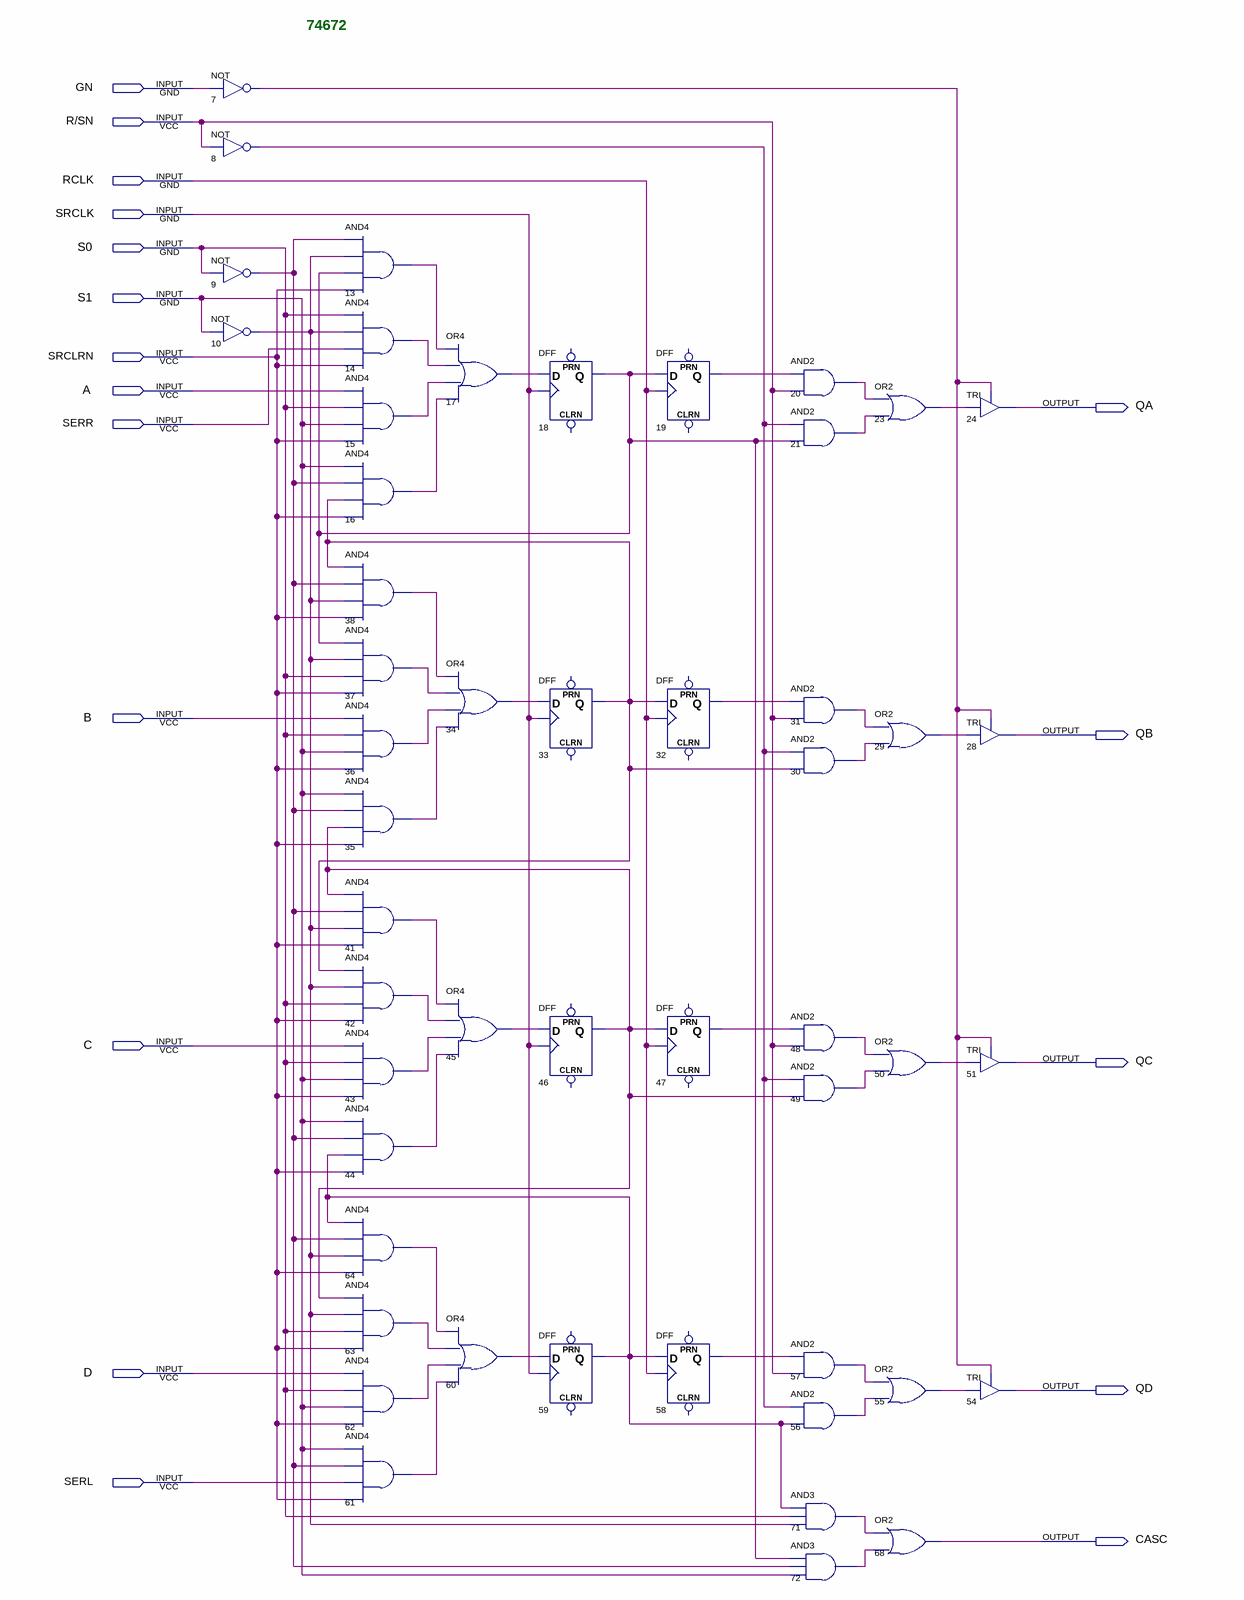
[diagram p0: schematic sheet]
// Quartus schematic 74672.bdf as structural Verilog: 51 symbols, 18 pins
module \74672  (
  input  GN,
  input  \R/SN ,
  input  RCLK,
  input  SRCLK,
  input  S0,
  input  S1,
  input  SRCLRN,
  input  A,
  input  SERR,
  input  B,
  input  C,
  input  D,
  input  SERL,
  output QA,
  output QB,
  output QC,
  output QD,
  output CASC
);

  wire n7_out, n8_out, n9_out, n10_out, n13_out, n14_out, n15_out, n16_out, n17_out, n18_q, n19_q, n20_out,
       n21_out, n23_out, n29_out, n30_out, n31_out, n32_q, n33_q, n34_out, n35_out, n36_out, n37_out,
       n38_out, n41_out, n42_out, n43_out, n44_out, n45_out, n46_q, n47_q, n48_out, n49_out, n50_out,
       n55_out, n56_out, n57_out, n58_q, n59_q, n60_out, n61_out, n62_out, n63_out, n64_out, n71_out, n72_out;

  not u_7 (n7_out, GN);
  not u_8 (n8_out, \R/SN );
  not u_9 (n9_out, S0);
  not u_10 (n10_out, S1);
  and u_13 (n13_out, n9_out, n10_out, n18_q, SRCLRN);
  and u_14 (n14_out, S0, n10_out, SERR, SRCLRN);
  and u_15 (n15_out, A, S0, S1, SRCLRN);
  and u_16 (n16_out, S1, n9_out, n33_q, SRCLRN);
  and u_38 (n38_out, n33_q, n9_out, n10_out, SRCLRN);
  and u_37 (n37_out, n18_q, n10_out, S0, SRCLRN);
  and u_36 (n36_out, B, S0, S1, SRCLRN);
  and u_35 (n35_out, S1, n9_out, n46_q, SRCLRN);
  and u_41 (n41_out, n46_q, n9_out, n10_out, SRCLRN);
  and u_42 (n42_out, n33_q, n10_out, S0, SRCLRN);
  and u_43 (n43_out, C, S0, S1, SRCLRN);
  and u_44 (n44_out, S1, n9_out, n59_q, SRCLRN);
  and u_64 (n64_out, n59_q, n9_out, n10_out, SRCLRN);
  and u_63 (n63_out, n46_q, n10_out, S0, SRCLRN);
  and u_62 (n62_out, D, S0, S1, SRCLRN);
  and u_61 (n61_out, S1, n9_out, SERL, SRCLRN);
  or u_17 (n17_out, n13_out, n14_out, n15_out, n16_out);
  or u_34 (n34_out, n38_out, n37_out, n36_out, n35_out);
  or u_45 (n45_out, n41_out, n42_out, n43_out, n44_out);
  or u_60 (n60_out, n64_out, n63_out, n62_out, n61_out);
  DFF u_18 (.CLK(SRCLK), .D(n17_out), .Q(n18_q));  // open: CLRN, PRN
  DFF u_33 (.CLK(SRCLK), .D(n34_out), .Q(n33_q));  // open: CLRN, PRN
  DFF u_46 (.CLK(SRCLK), .D(n45_out), .Q(n46_q));  // open: CLRN, PRN
  DFF u_59 (.CLK(SRCLK), .D(n60_out), .Q(n59_q));  // open: CLRN, PRN
  DFF u_19 (.CLK(RCLK), .D(n18_q), .Q(n19_q));  // open: CLRN, PRN
  DFF u_32 (.CLK(RCLK), .D(n33_q), .Q(n32_q));  // open: CLRN, PRN
  DFF u_47 (.CLK(RCLK), .D(n46_q), .Q(n47_q));  // open: CLRN, PRN
  DFF u_58 (.CLK(RCLK), .D(n59_q), .Q(n58_q));  // open: CLRN, PRN
  and u_20 (n20_out, n19_q, \R/SN );
  and u_21 (n21_out, n8_out, n18_q);
  and u_31 (n31_out, n32_q, \R/SN );
  and u_30 (n30_out, n8_out, n33_q);
  and u_48 (n48_out, n47_q, \R/SN );
  and u_49 (n49_out, n8_out, n46_q);
  and u_57 (n57_out, n58_q, \R/SN );
  and u_56 (n56_out, n8_out, n59_q);
  and u_71 (n71_out, n59_q, S0, n10_out);
  and u_72 (n72_out, n18_q, n9_out, S1);
  or u_23 (n23_out, n20_out, n21_out);
  or u_29 (n29_out, n31_out, n30_out);
  or u_50 (n50_out, n48_out, n49_out);
  or u_55 (n55_out, n57_out, n56_out);
  or u_68 (CASC, n71_out, n72_out);
  TRI u_24 (.IN(n23_out), .OE(n7_out), .OUT(QA));
  TRI u_28 (.IN(n29_out), .OE(n7_out), .OUT(QB));
  TRI u_51 (.IN(n50_out), .OE(n7_out), .OUT(QC));
  TRI u_54 (.IN(n55_out), .OE(n7_out), .OUT(QD));

  // Notes on the sheet:
  //   74672
endmodule
